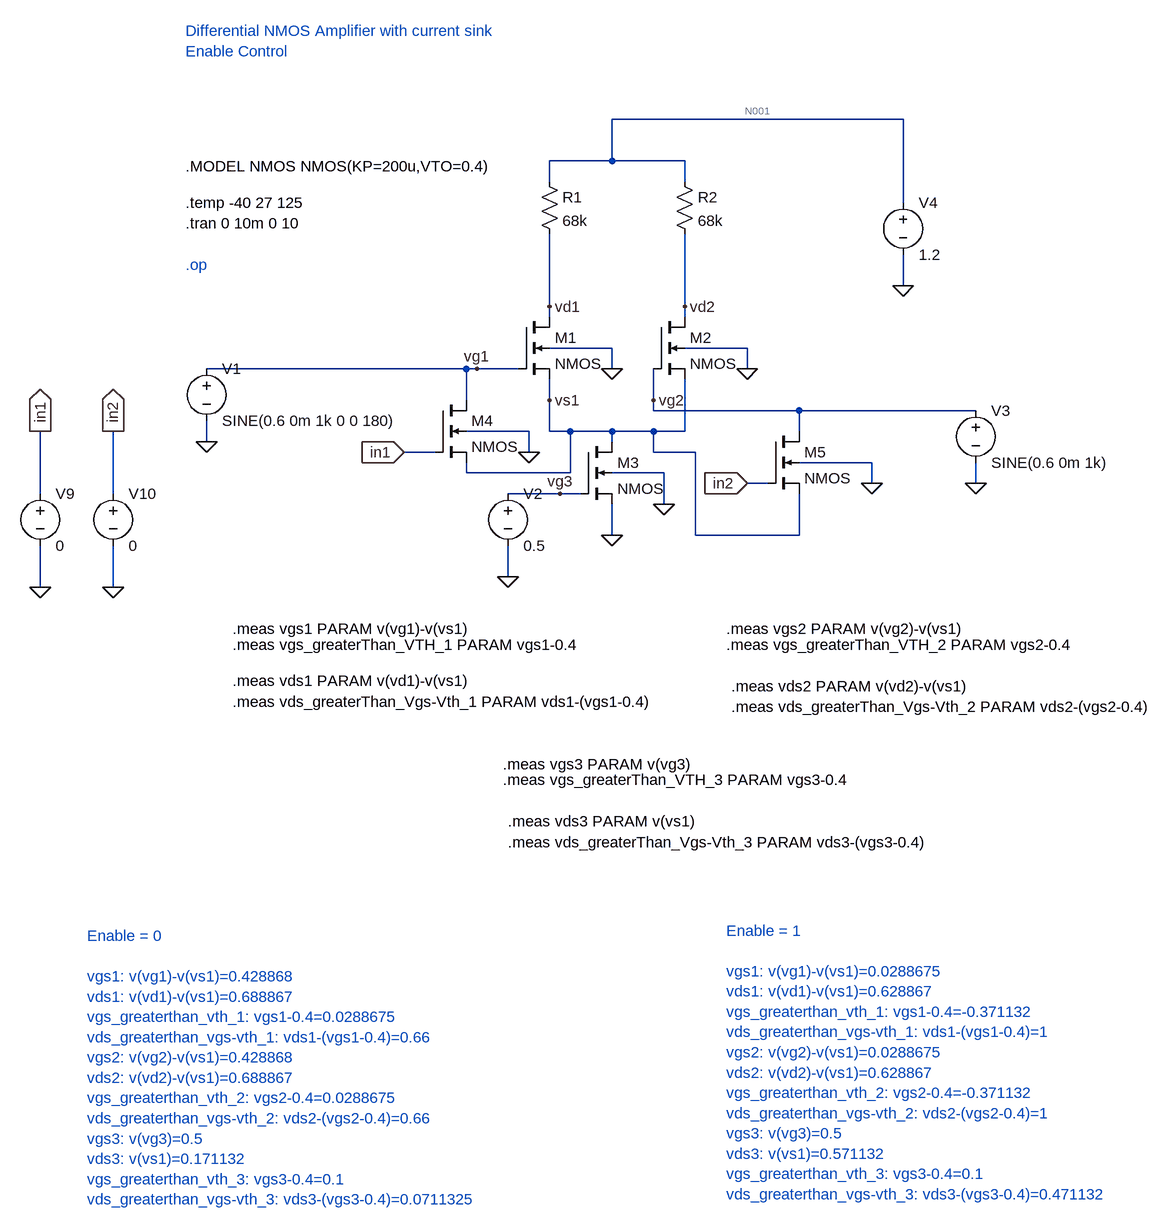
[diagram p0: schematic 2_Differential_amplifier_EnablePin.asc]
2_Differential_amplifier_EnablePin.asc, the LTspice schematic file:
Version 4
SHEET 1 2076 1364
WIRE 672 -272 224 -272
WIRE 224 -208 224 -272
WIRE 224 -208 128 -208
WIRE 336 -208 224 -208
WIRE 128 -176 128 -208
WIRE 336 -176 336 -208
WIRE 672 -144 672 -272
WIRE 672 -16 672 -64
WIRE 128 16 128 -96
WIRE 336 16 336 -96
WIRE 128 32 128 16
WIRE 336 32 336 16
WIRE 224 80 128 80
WIRE 432 80 336 80
WIRE 0 112 -400 112
WIRE 16 112 0 112
WIRE 80 112 16 112
WIRE 224 112 224 80
WIRE 432 112 432 80
WIRE 0 160 0 112
WIRE 128 160 128 128
WIRE 288 160 288 112
WIRE 288 176 288 160
WIRE 512 176 288 176
WIRE 784 176 512 176
WIRE 96 208 0 208
WIRE 128 208 128 160
WIRE 160 208 128 208
WIRE 224 208 160 208
WIRE 288 208 224 208
WIRE 336 208 336 128
WIRE 336 208 288 208
WIRE 512 208 512 176
WIRE -400 224 -400 192
WIRE 224 224 224 208
WIRE -48 240 -96 240
WIRE 96 240 96 208
WIRE 288 240 288 208
WIRE 352 240 288 240
WIRE 624 256 512 256
WIRE 0 272 0 256
WIRE 160 272 160 208
WIRE 160 272 0 272
WIRE 304 272 224 272
WIRE 464 288 432 288
WIRE 624 288 624 256
WIRE 784 288 784 256
WIRE -656 304 -656 208
WIRE -544 304 -544 208
WIRE 144 304 64 304
WIRE 176 304 144 304
WIRE 304 320 304 272
WIRE 224 368 224 320
WIRE 352 368 352 240
WIRE 512 368 512 304
WIRE 512 368 352 368
WIRE 64 432 64 384
WIRE -656 448 -656 384
WIRE -544 448 -544 384
FLAG -400 224 0
FLAG 224 368 0
FLAG 224 112 0
FLAG 432 112 0
FLAG 784 288 0
FLAG 672 -16 0
FLAG 64 432 0
FLAG 304 320 0
FLAG 16 112 vg1
FLAG 128 160 vs1
FLAG 128 16 vd1
FLAG 288 160 vg2
FLAG 336 16 vd2
FLAG 144 304 vg3
FLAG -656 448 0
FLAG -544 448 0
FLAG -656 208 in1
IOPIN -656 208 Out
FLAG -544 208 in2
IOPIN -544 208 Out
FLAG 624 288 0
FLAG 96 240 0
FLAG -96 240 in1
IOPIN -96 240 In
FLAG 432 288 in2
IOPIN 432 288 In
SYMBOL nmos4 80 32 R0
SYMATTR InstName M1
SYMATTR Value2 l=1u w=60u
SYMBOL nmos4 288 32 R0
SYMATTR InstName M2
SYMATTR Value2 l=1u w=60u
SYMBOL nmos4 176 224 R0
SYMATTR InstName M3
SYMATTR Value2 l=1u w=10u
SYMBOL voltage -400 96 R0
WINDOW 123 0 0 Left 0
WINDOW 39 0 0 Left 0
SYMATTR InstName V1
SYMATTR Value SINE(0.6 0m 1k 0 0 180)
SYMBOL voltage 64 288 R0
WINDOW 123 0 0 Left 0
WINDOW 39 0 0 Left 0
SYMATTR InstName V2
SYMATTR Value 0.5
SYMBOL voltage 784 160 R0
WINDOW 123 0 0 Left 0
WINDOW 39 0 0 Left 0
SYMATTR InstName V3
SYMATTR Value SINE(0.6 0m 1k)
SYMBOL voltage 672 -160 R0
WINDOW 123 0 0 Left 0
WINDOW 39 0 0 Left 0
SYMATTR InstName V4
SYMATTR Value 1.2
SYMBOL res 112 -192 R0
SYMATTR InstName R1
SYMATTR Value 68k
SYMBOL res 320 -192 R0
SYMATTR InstName R2
SYMATTR Value 68k
SYMBOL voltage -656 288 R0
WINDOW 123 0 0 Left 0
WINDOW 39 0 0 Left 0
SYMATTR InstName V9
SYMATTR Value 0
SYMBOL voltage -544 288 R0
WINDOW 123 0 0 Left 0
WINDOW 39 0 0 Left 0
SYMATTR InstName V10
SYMATTR Value 0
SYMBOL nmos4 -48 160 R0
SYMATTR InstName M4
SYMATTR Value2 l=1u w=60u
SYMBOL nmos4 464 208 R0
SYMATTR InstName M5
SYMATTR Value2 l=1u w=60u
TEXT -432 -408 Left 2 ;Differential NMOS Amplifier with current sink\nEnable Control
TEXT -432 -200 Left 2 !.MODEL NMOS NMOS(KP=200u,VTO=0.4)
TEXT -432 -112 Left 2 !.tran 0 10m 0 10
TEXT -360 512 Left 2 !.meas vgs1 PARAM v(vg1)-v(vs1)
TEXT -360 592 Left 2 !.meas vds1 PARAM v(vd1)-v(vs1)
TEXT -360 536 Left 2 !.meas vgs_greaterThan_VTH_1 PARAM vgs1-0.4
TEXT -360 624 Left 2 !.meas vds_greaterThan_Vgs-Vth_1 PARAM vds1-(vgs1-0.4)
TEXT 400 512 Left 2 !.meas vgs2 PARAM v(vg2)-v(vs1)
TEXT 408 600 Left 2 !.meas vds2 PARAM v(vd2)-v(vs1)
TEXT 400 536 Left 2 !.meas vgs_greaterThan_VTH_2 PARAM vgs2-0.4
TEXT 408 632 Left 2 !.meas vds_greaterThan_Vgs-Vth_2 PARAM vds2-(vgs2-0.4)
TEXT 56 720 Left 2 !.meas vgs3 PARAM v(vg3)
TEXT 64 808 Left 2 !.meas vds3 PARAM v(vs1)
TEXT 56 744 Left 2 !.meas vgs_greaterThan_VTH_3 PARAM vgs3-0.4
TEXT 64 840 Left 2 !.meas vds_greaterThan_Vgs-Vth_3 PARAM vds3-(vgs3-0.4)
TEXT -432 -48 Left 2 ;.op
TEXT -432 -144 Left 2 !.temp -40 27 125
TEXT -584 984 Left 2 ;Enable = 0\n \nvgs1: v(vg1)-v(vs1)=0.428868\nvds1: v(vd1)-v(vs1)=0.688867\nvgs_greaterthan_vth_1: vgs1-0.4=0.0288675\nvds_greaterthan_vgs-vth_1: vds1-(vgs1-0.4)=0.66\nvgs2: v(vg2)-v(vs1)=0.428868\nvds2: v(vd2)-v(vs1)=0.688867\nvgs_greaterthan_vth_2: vgs2-0.4=0.0288675\nvds_greaterthan_vgs-vth_2: vds2-(vgs2-0.4)=0.66\nvgs3: v(vg3)=0.5\nvds3: v(vs1)=0.171132\nvgs_greaterthan_vth_3: vgs3-0.4=0.1\nvds_greaterthan_vgs-vth_3: vds3-(vgs3-0.4)=0.0711325
TEXT 400 976 Left 2 ;Enable = 1\n \nvgs1: v(vg1)-v(vs1)=0.0288675\nvds1: v(vd1)-v(vs1)=0.628867\nvgs_greaterthan_vth_1: vgs1-0.4=-0.371132\nvds_greaterthan_vgs-vth_1: vds1-(vgs1-0.4)=1\nvgs2: v(vg2)-v(vs1)=0.0288675\nvds2: v(vd2)-v(vs1)=0.628867\nvgs_greaterthan_vth_2: vgs2-0.4=-0.371132\nvds_greaterthan_vgs-vth_2: vds2-(vgs2-0.4)=1\nvgs3: v(vg3)=0.5\nvds3: v(vs1)=0.571132\nvgs_greaterthan_vth_3: vgs3-0.4=0.1\nvds_greaterthan_vgs-vth_3: vds3-(vgs3-0.4)=0.471132

The netlist it stands for:
* 2_Differential_amplifier_EnablePin.asc
M1 vd1 vg1 vs1 0 NMOS l=1u w=60u
M2 vd2 vg2 vs1 0 NMOS l=1u w=60u
M3 vs1 vg3 0 0 NMOS l=1u w=10u
V1 vg1 0 SINE(0.6 0m 1k 0 0 180)
V2 vg3 0 0.5
V3 vg2 0 SINE(0.6 0m 1k)
V4 N001 0 1.2
R1 N001 vd1 68k
R2 N001 vd2 68k
V9 in1 0 0
V10 in2 0 0
M4 vg1 in1 vs1 0 NMOS l=1u w=60u
M5 vg2 in2 vs1 0 NMOS l=1u w=60u
.model NMOS NMOS
.model PMOS PMOS
.lib standard.mos
* Differential NMOS Amplifier with current sink
* Enable Control
.MODEL NMOS NMOS(KP=200u,VTO=0.4)
.tran 0 10m 0 10
.meas vgs1 PARAM v(vg1)-v(vs1)
.meas vds1 PARAM v(vd1)-v(vs1)
.meas vgs_greaterThan_VTH_1 PARAM vgs1-0.4
.meas vds_greaterThan_Vgs-Vth_1 PARAM vds1-(vgs1-0.4)
.meas vgs2 PARAM v(vg2)-v(vs1)
.meas vds2 PARAM v(vd2)-v(vs1)
.meas vgs_greaterThan_VTH_2 PARAM vgs2-0.4
.meas vds_greaterThan_Vgs-Vth_2 PARAM vds2-(vgs2-0.4)
.meas vgs3 PARAM v(vg3)
.meas vds3 PARAM v(vs1)
.meas vgs_greaterThan_VTH_3 PARAM vgs3-0.4
.meas vds_greaterThan_Vgs-Vth_3 PARAM vds3-(vgs3-0.4)
* .op
.temp -40 27 125
* Enable = 0
* vgs1: v(vg1)-v(vs1)=0.428868
* vds1: v(vd1)-v(vs1)=0.688867
* vgs_greaterthan_vth_1: vgs1-0.4=0.0288675
* vds_greaterthan_vgs-vth_1: vds1-(vgs1-0.4)=0.66
* vgs2: v(vg2)-v(vs1)=0.428868
* vds2: v(vd2)-v(vs1)=0.688867
* vgs_greaterthan_vth_2: vgs2-0.4=0.0288675
* vds_greaterthan_vgs-vth_2: vds2-(vgs2-0.4)=0.66
* vgs3: v(vg3)=0.5
* vds3: v(vs1)=0.171132
* vgs_greaterthan_vth_3: vgs3-0.4=0.1
* vds_greaterthan_vgs-vth_3: vds3-(vgs3-0.4)=0.0711325
* Enable = 1
* vgs1: v(vg1)-v(vs1)=0.0288675
* vds1: v(vd1)-v(vs1)=0.628867
* vgs_greaterthan_vth_1: vgs1-0.4=-0.371132
* vds_greaterthan_vgs-vth_1: vds1-(vgs1-0.4)=1
* vgs2: v(vg2)-v(vs1)=0.0288675
* vds2: v(vd2)-v(vs1)=0.628867
* vgs_greaterthan_vth_2: vgs2-0.4=-0.371132
* vds_greaterthan_vgs-vth_2: vds2-(vgs2-0.4)=1
* vgs3: v(vg3)=0.5
* vds3: v(vs1)=0.571132
* vgs_greaterthan_vth_3: vgs3-0.4=0.1
* vds_greaterthan_vgs-vth_3: vds3-(vgs3-0.4)=0.471132
.backanno
.end

* Results of the author's LTspice run, read from the files saved beside the schematic
* Operating Point (first step), zero values left out:
*   temperature = -40 
*   V(vd1) = 1.14 V
*   V(vg1) = 600 mV
*   V(vs1) = 124.8 mV
*   V(vd2) = 1.14 V
*   V(vg2) = 600 mV
*   V(vg3) = 500 mV
*   V(n001) = 1.2 V
*   Id(M5) = 1.075 pA
*   Id(M4) = 1.075 pA
*   Id(M3) = 1.779 µA
*   Is(M3) = -1.779 µA
*   Id(M2) = 889.5 nA
*   Ib(M2) = -1.264 pA
*   Is(M2) = -889.5 nA
*   Id(M1) = 889.5 nA
*   Ib(M1) = -1.264 pA
*   Is(M1) = -889.5 nA
*   I(R2) = 889.5 nA
*   I(R1) = 889.5 nA
*   I(V4) = -1.779 µA
*   I(V3) = -1.075 pA
*   I(V1) = -1.075 pA
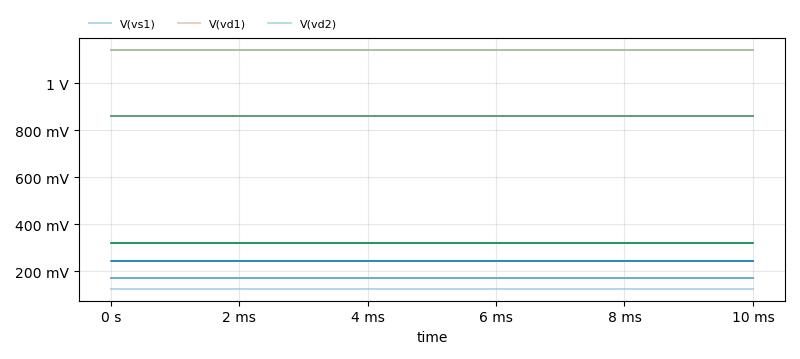
[diagram p1: Transient Analysis of 2_Differential_amplifier_EnablePin.asc, plotted from the saved traces]
* Transient Analysis, 3 runs:
*   V(vs1) [temp=-40°C]: min 124.8 mV, max 124.8 mV, average 124.8 mV, rms 124.8 mV, last 124.8 mV
*   V(vs1) [temp=27°C]: min 171.1 mV, max 171.1 mV, average 171.1 mV, rms 171.1 mV, last 171.1 mV
*   V(vs1) [temp=125°C]: min 241.3 mV, max 241.3 mV, average 241.3 mV, rms 241.3 mV, last 241.3 mV
*   V(vd1) [temp=-40°C]: min 1.14 V, max 1.14 V, average 1.14 V, rms 1.14 V, last 1.14 V
*   V(vd1) [temp=27°C]: min 860 mV, max 860 mV, average 860 mV, rms 860 mV, last 860 mV
*   V(vd1) [temp=125°C]: min 321.8 mV, max 321.8 mV, average 321.8 mV, rms 321.8 mV, last 321.8 mV
*   V(vd2) [temp=-40°C]: min 1.14 V, max 1.14 V, average 1.14 V, rms 1.14 V, last 1.14 V
*   V(vd2) [temp=27°C]: min 860 mV, max 860 mV, average 860 mV, rms 860 mV, last 860 mV
*   V(vd2) [temp=125°C]: min 321.8 mV, max 321.8 mV, average 321.8 mV, rms 321.8 mV, last 321.8 mV
* From the log:
*   Measurement: vgs1
*     step  v(vg1)-v(vs1)
*        1  0.475176
*        2  0.428868
*        3  0.358715
*   Measurement: vds1
*     step  v(vd1)-v(vs1)
*        1  1.01469
*        2  0.688867
*        3  0.080465
*   Measurement: vgs_greaterthan_vth_1
*     step  vgs1-0.4
*        1  0.0751762
*        2  0.0288675
*        3  -0.0412853
*   Measurement: vds_greaterthan_vgs-vth_1
*     step  vds1-(vgs1-0.4)
*        1  0.939517
*        2  0.66
*        3  0.12175
*   Measurement: vgs2
*     step  v(vg2)-v(vs1)
*        1  0.475176
*        2  0.428868
*        3  0.358715
*   Measurement: vds2
*     step  v(vd2)-v(vs1)
*        1  1.01469
*        2  0.688867
*        3  0.080465
*   Measurement: vgs_greaterthan_vth_2
*     step  vgs2-0.4
*        1  0.0751762
*        2  0.0288675
*        3  -0.0412853
*   Measurement: vds_greaterthan_vgs-vth_2
*     step  vds2-(vgs2-0.4)
*        1  0.939517
*        2  0.66
*        3  0.12175
*   Measurement: vgs3
*     step  v(vg3)
*        1  0.5
*        2  0.5
*        3  0.5
*   Measurement: vds3
*     step  v(vs1)
*        1  0.124824
*        2  0.171132
*        3  0.241285
*   Measurement: vgs_greaterthan_vth_3
*     step  vgs3-0.4
*        1  0.1
*        2  0.1
*        3  0.1
*   Measurement: vds_greaterthan_vgs-vth_3
*     step  vds3-(vgs3-0.4)
*        1  0.0248238
*        2  0.0711325
*        3  0.141285